# Altium schematic sheet Display.SchDoc: GSM
size A4; SheetNumber: 10; SheetTotal: 10
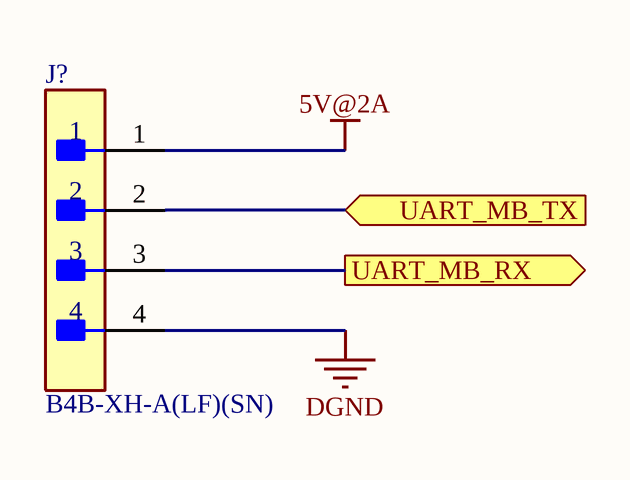
[diagram p0: Display.SchDoc]

## Parts
J?  B4B-XH-A(LF)(SN)  [FP-B4B-XH-A_LF_SN-MFG]

## Ports
UART_MB_RX (out), UART_MB_TX (in)

## Nets
5V@2A: J?.1
DGND: J?.4
UART_MB_RX: J?.3 ; port UART_MB_RX
UART_MB_TX: J?.2 ; port UART_MB_TX

## Notes on the sheet
- Title
- Size:
- Date:
- A3
- Author:
- Time:
- Revision:
- Sheet
- of
- File:

## Library data of the parts
J? = CMP-17439-000250-1: CONN HEADER VERT 4POS 2.5MM; Number of Contacts: 4; Contact Resistance: 20mR; Voltage Rating: 250V; Max Current Rating: 3A; Gender: Male; Wire/Cable Gauge: 22AWG; Mated Stacking Heights: 9.8mm; Insulation Resistance: 1GR; Orientation: Straight; Contact Type: Male Pin; Contact Finish - Mating: TIN; Series: XH; Max Voltage Rating (AC): 250V; Lead Pitch: 2.5mm; Contact Shape: Square; Insulation Color: Natural; Termination: Solder; Lead Free: Lead Free; Voltage Rating (AC): 250V; Number of Rows: 1; Flammability Rating: UL94 V-0; Number of Positions: 4; Max Operating Temperature: 85°C; Package Quantity: 500; Mount: Through Hole; REACH SVHC: No SVHC; Connector Type: Header; Insulation Material: Nylon; Fastening Type: Detent; Min Operating Temperature: -25°C; Housing Color: White; Packaging: Bulk; Contact Plating: Tin; Contact Material: Brass; Max Voltage Rating (DC): 250V; Housing Material: Polyamide; Color: Natural; Material: Polyamide; Pitch: 2.5mm; Depth: 5.75mm; Current Rating: 3A; Length: 12.4mm; LCSC_PN: C144395